# Altium project Flip.PrjPcb
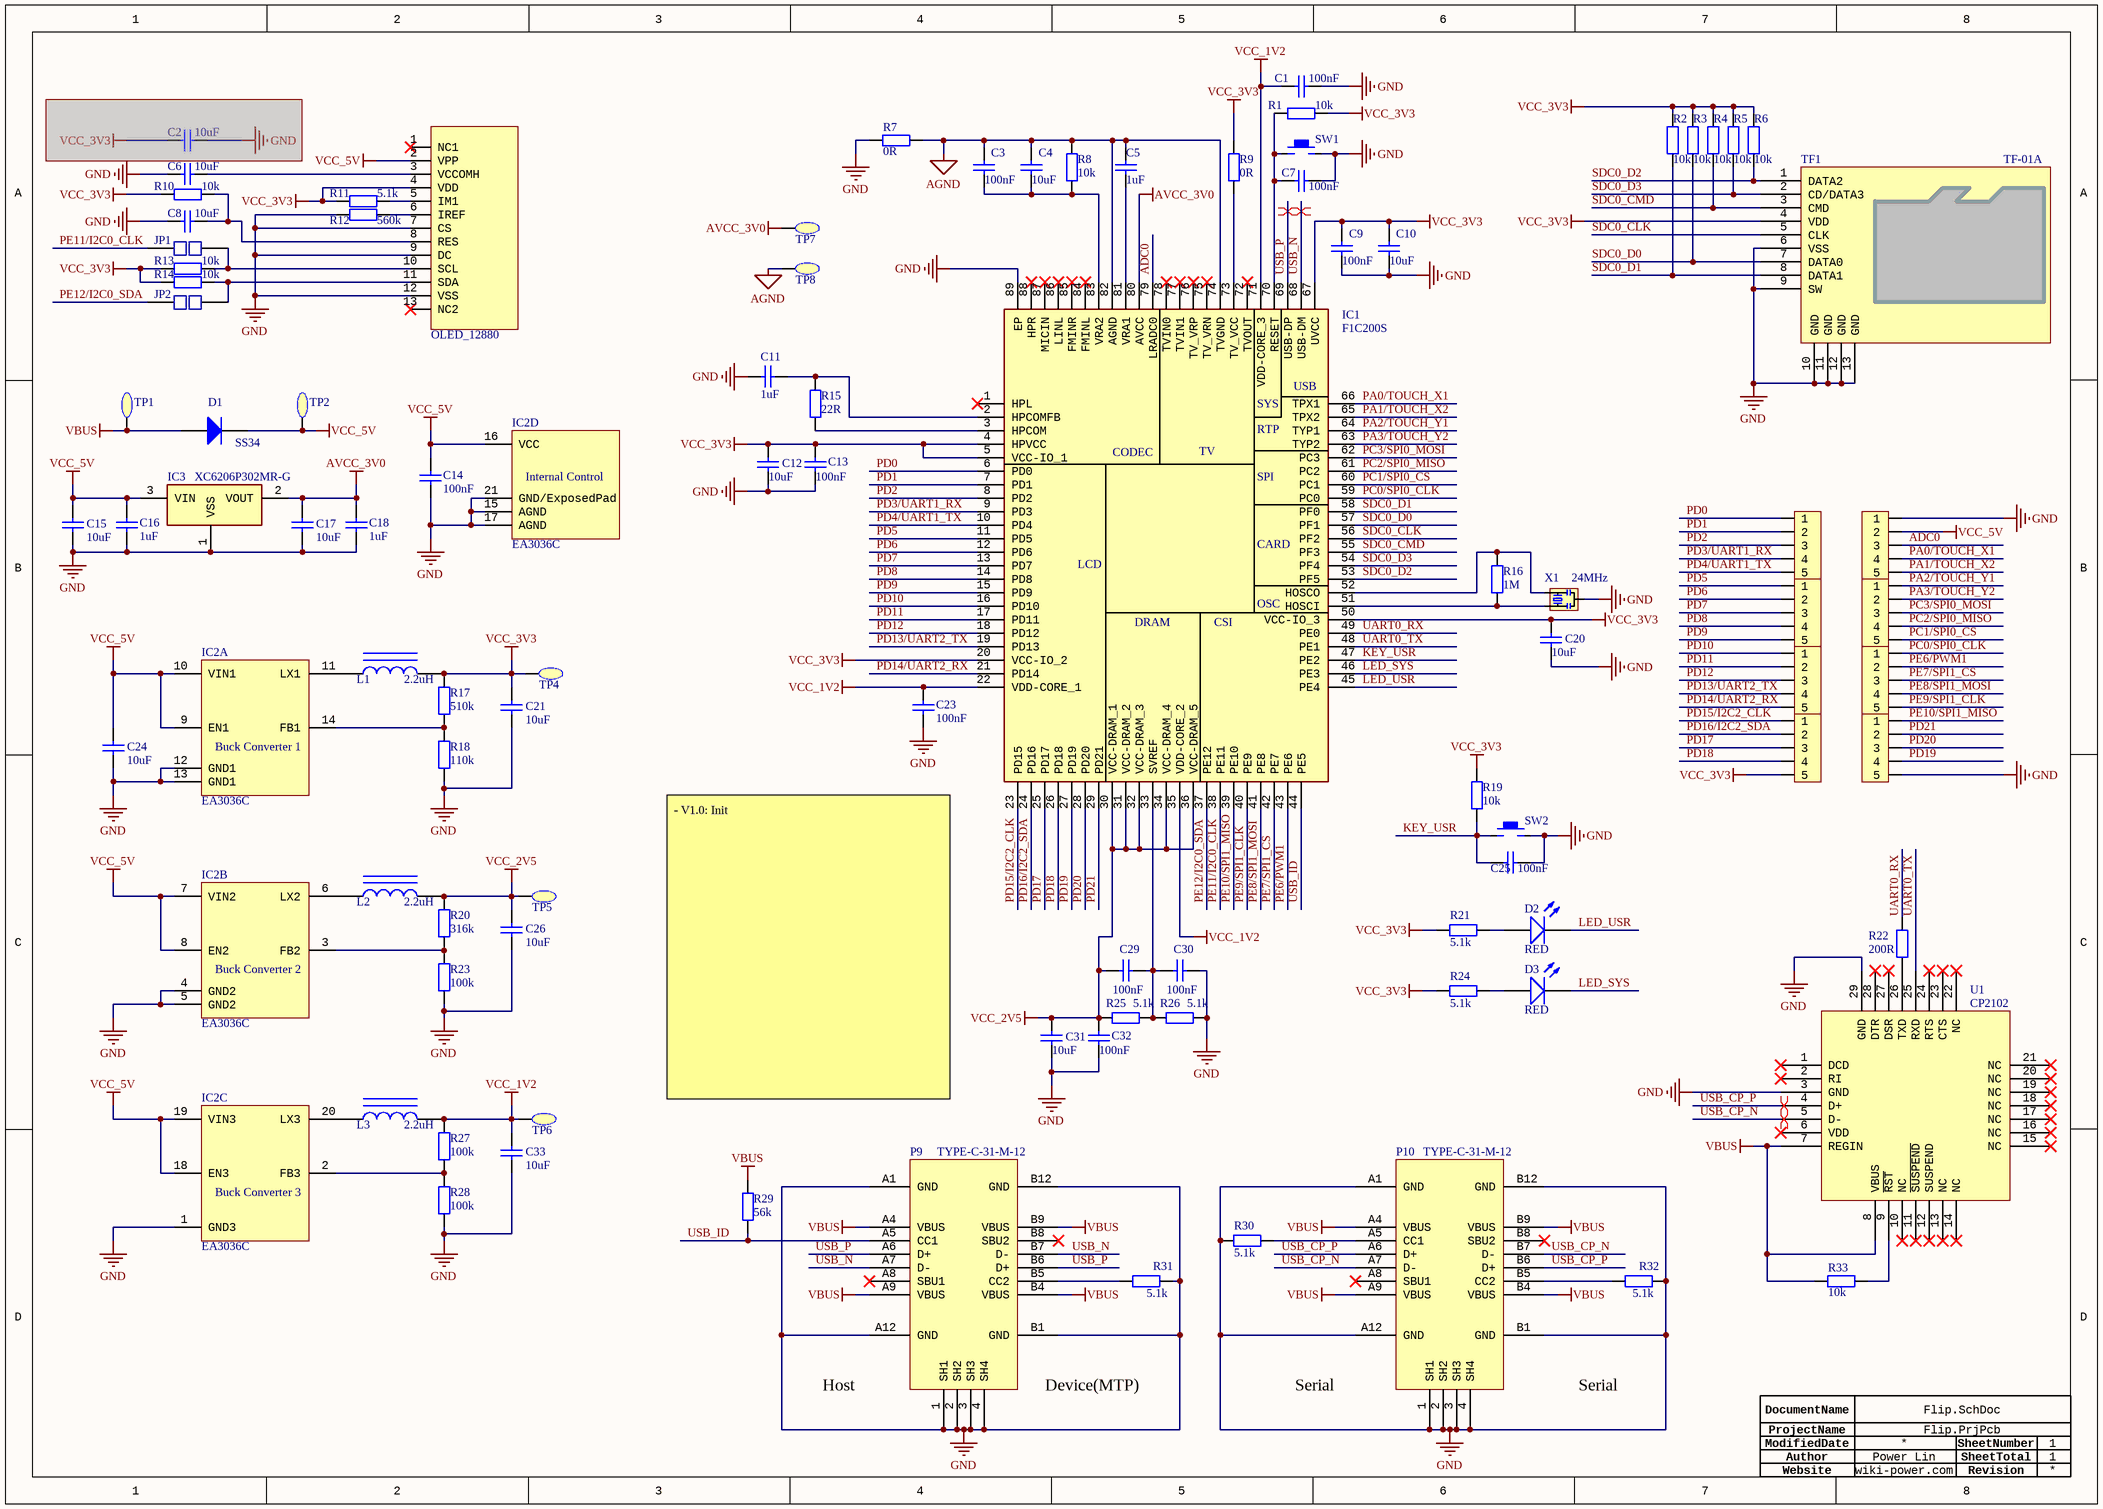
[diagram p0: Flip.SchDoc]
1 sheet, 96 parts. Net scope: global (net labels, ports and power ports of the same name join across sheets).
Board file: Flip.PcbDoc

## Sheet Flip.SchDoc
size A3; Author: Power Lin; SheetNumber: 1; SheetTotal: 1; Website: wiki-power.com

### Parts
C1  100nF  [CAP-0402]
C2  10uF  [CAP-0402]  (masked out: inside a compile mask, not in the netlist)
C3  100nF  [CAP-0402]
C4  10uF  [CAP-0402]
C5  1uF  [CAP-0402]
C6  10uF  [CAP-0402]
C7  100nF  [CAP-0402]
C8  10uF  [CAP-0402]
C9  100nF  [CAP-0402]
C10  10uF  [CAP-0402]
C11  1uF  [CAP-0402]
C12  10uF  [CAP-0402]
C13  100nF  [CAP-0402]
C14  100nF  [CAP-0402]
C15  10uF  [CAP-0402]
C16  1uF  [CAP-0402]
C17  10uF  [CAP-0402]
C18  1uF  [CAP-0402]
C20  10uF  [CAP-0402]
C21  10uF  [CAP-0402]
C23  100nF  [CAP-0402]
C24  10uF  [CAP-0402]
C25  100nF  [CAP-0402]
C26  10uF  [CAP-0402]
C29  100nF  [CAP-0402]
C30  100nF  [CAP-0402]
C31  10uF  [CAP-0402]
C32  100nF  [CAP-0402]
C33  10uF  [CAP-0402]
D1  SS34  [DO-214AC/SMA]
D2  RED  [LED-0402]
D3  RED  [LED-0402]
IC1  F1C200S  [QFN88P_10X10mm]
IC2  EA3036C  [QFN3mmx3mm-20]  (parts A,B,C,D of 4)
IC3  XC6206P302MR-G  [SOT-23-3]
JP1  Select  [选择焊点-0402]  (value not drawn)
JP2  Select  [选择焊点-0402]  (value not drawn)
L1  2.2uH  [L-1008]
L2  2.2uH  [L-1008]
L3  2.2uH  [L-1008]
M1  OLED_12880  [OLED_0.78INCH_12880]
P1  HDR1x5  [HDR1X5_2.54_180_BLANK]  (value not drawn)
P2  HDR1x5  [HDR1X5_2.54_180_BLANK]  (value not drawn)
P3  HDR1x5  [HDR1X5_2.54_180_BLANK]  (value not drawn)
P4  HDR1x5  [HDR1X5_2.54_180_BLANK]  (value not drawn)
P5  HDR1x5  [HDR1X5_2.54_180_BLANK]  (value not drawn)
P6  HDR1x5  [HDR1X5_2.54_180_BLANK]  (value not drawn)
P7  HDR1x5  [HDR1X5_2.54_180_BLANK]  (value not drawn)
P8  HDR1x5  [HDR1X5_2.54_180_BLANK]  (value not drawn)
P9  TYPE-C-31-M-12  [Type-C_16+4P]
P10  TYPE-C-31-M-12  [Type-C_16+4P]
R1  10k  [R-0402]
R2  10k  [R-0402]
R3  10k  [R-0402]
R4  10k  [R-0402]
R5  10k  [R-0402]
R6  10k  [R-0402]
R7  0R  [R-0402]
R8  10k  [R-0402]
R9  0R  [R-0402]
R10  10k  [R-0402]
R11  5.1k  [R-0402]
R12  560k  [R-0402]
R13  10k  [R-0402]
R14  10k  [R-0402]
R15  22R  [R-0402]
R16  1M  [R-0402]
R17  510k  [R-0402]
R18  110k  [R-0402]
R19  10k  [R-0402]
R20  316k  [R-0402]
R21  5.1k  [R-0402]
R22  200R  [R-0402]
R23  100k  [R-0402]
R24  5.1k  [R-0402]
R25  5.1k  [R-0402]
R26  5.1k  [R-0402]
R27  100k  [R-0402]
R28  100k  [R-0402]
R29  56k  [R-0402]
R30  5.1k  [R-0402]
R31  5.1k  [R-0402]
R32  5.1k  [R-0402]
R33  10k  [R-0402]
SW1  KEY  [KEY-4P-4.2*3.4*2.5]  (value not drawn)
SW2  KEY  [KEY-4P-4.2*3.4*2.5]  (value not drawn)
TF1  TF-01A  [TF_1]
TP1  TestPoint  [TestPoint]  (value not drawn)
TP2  TestPoint  [TestPoint]  (value not drawn)
TP4  TestPoint  [TestPoint]  (value not drawn)
TP5  TestPoint  [TestPoint]  (value not drawn)
TP6  TestPoint  [TestPoint]  (value not drawn)
TP7  TestPoint  [TestPoint]  (value not drawn)
TP8  TestPoint  [TestPoint]  (value not drawn)
U1  CP2102  [QFN28]
X1  24MHz  [SMD3213-3P]

### Nets
AGND: C3.1 C4.2 C5.1 IC1.74(TVGND) IC1.82(AGND) R7.1 R8.2 TP8.1
AVCC_3V0: C17.2 C18.1 IC1.80(AVCC) IC3.2(VOUT) TP7.1
GND: C1.1 C6.2 C7.1 C8.2 C9.2 C10.1 C11.1 C12.1 C13.1 C14.1 C15.1 C16.2 C17.1 C18.2 C20.1 C21.1 C23.1 C24.1 C25.1 C26.1 C30.2 C31.1 C32.1 C33.1 IC1.89(EP) IC2.1(GND3) IC2.4(GND2) IC2.5(GND2) IC2.12(GND1) IC2.13(GND1) IC2.15(AGND) IC2.17(AGND) IC2.21(GND/ExposedPad) IC3.1(VSS) M1.7(CS) M1.9(DC) M1.12(VSS) P2.1 P8.5 P9.1(SH1) P9.2(SH2) P9.3(SH3) P9.4(SH4) P9.A1(GND) P9.A12(GND) P9.B1(GND) P9.B12(GND) P10.1(SH1) P10.2(SH2) P10.3(SH3) P10.4(SH4) P10.A1(GND) P10.A12(GND) P10.B1(GND) P10.B12(GND) R7.2 R12.1 R18.1 R23.1 R26.2 R28.1 R30.2 R31.2 R32.2 SW1.2 SW2.2 TF1.6(VSS) TF1.9(SW) TF1.10(GND) TF1.11(GND) TF1.12(GND) TF1.13(GND) U1.3(GND) U1.29(GND) X1.2(GND)
VBUS: D1.1(A) P9.A4(VBUS) P9.A9(VBUS) P9.B4(VBUS) P9.B9(VBUS) P10.A4(VBUS) P10.A9(VBUS) P10.B4(VBUS) P10.B9(VBUS) R29.1 R33.2 TP1.1 U1.7(REGIN) U1.8(VBUS)
VCC_1V2: C1.2 C23.2 C33.2 IC1.22(VDD-CORE_1) IC1.35(VDD-CORE_2) IC1.71(VDD-CORE_3) L3.2 R27.2 TP6.1
VCC_2V5: C26.2 C29.1 C31.2 C32.2 IC1.30(VCC-DRAM_1) IC1.31(VCC-DRAM_2) IC1.32(VCC-DRAM_3) IC1.34(VCC-DRAM_4) IC1.36(VCC-DRAM_5) L2.2 R20.2 R25.1 TP5.1
VCC_3V3: C9.1 C10.2 C12.2 C13.2 C20.2 C21.2 IC1.4(HPVCC) IC1.5(VCC-IO_1) IC1.20(VCC-IO_2) IC1.50(VCC-IO_3) IC1.67(UVCC) L1.2 M1.4(VDD) P7.5 R1.2 R2.2 R3.2 R4.2 R5.2 R6.2 R9.2 R10.1 R11.1 R13.1 R14.1 R17.2 R19.2 R21.1 R24.1 TF1.4(VDD) TP4.1
VCC_5V: C14.2 C15.2 C16.1 C24.2 D1.2(K) IC2.7(VIN2) IC2.8(EN2) IC2.9(EN1) IC2.10(VIN1) IC2.16(VCC) IC2.18(EN3) IC2.19(VIN3) IC3.3(VIN) M1.2(VPP) P2.2 TP2.1
ADC0: IC1.79(LRADC0) P2.3
KEY_USR: C25.2 IC1.47(PE2) R19.1 SW2.1
LED_SYS: D3.K IC1.46(PE3)
LED_USR: D2.K IC1.45(PE4)
PA0/TOUCH_X1: IC1.66(TPX1) P2.4
PA1/TOUCH_X2: IC1.65(TPX2) P2.5
PA2/TOUCH_Y1: IC1.64(TYP1) P4.1
PA3/TOUCH_Y2: IC1.63(TYP2) P4.2
PC0/SPI0_CLK: IC1.59(PC0) P6.1
PC1/SPI0_CS: IC1.60(PC1) P4.5
PC2/SPI0_MISO: IC1.61(PC2) P4.4
PC3/SPI0_MOSI: IC1.62(PC3) P4.3
PD0: IC1.6(PD0) P1.1
PD1: IC1.7(PD1) P1.2
PD2: IC1.8(PD2) P1.3
PD3/UART1_RX: IC1.9(PD3) P1.4
PD4/UART1_TX: IC1.10(PD4) P1.5
PD5: IC1.11(PD5) P3.1
PD6: IC1.12(PD6) P3.2
PD7: IC1.13(PD7) P3.3
PD8: IC1.14(PD8) P3.4
PD9: IC1.15(PD9) P3.5
PD10: IC1.16(PD10) P5.1
PD11: IC1.17(PD11) P5.2
PD12: IC1.18(PD12) P5.3
PD13/UART2_TX: IC1.19(PD13) P5.4
PD14/UART2_RX: IC1.21(PD14) P5.5
PD15/I2C2_CLK: IC1.23(PD15) P7.1
PD16/I2C2_SDA: IC1.24(PD16) P7.2
PD17: IC1.25(PD17) P7.3
PD18: IC1.26(PD18) P7.4
PD19: IC1.27(PD19) P8.4
PD20: IC1.28(PD20) P8.3
PD21: IC1.29(PD21) P8.2
PE6/PWM1: IC1.43(PE6) P6.2
PE7/SPI1_CS: IC1.42(PE7) P6.3
PE8/SPI1_MOSI: IC1.41(PE8) P6.4
PE9/SPI1_CLK: IC1.40(PE9) P6.5
PE10/SPI1_MISO: IC1.39(PE10) P8.1
PE11/I2C0_CLK: IC1.38(PE11) JP1.1
PE12/I2C0_SDA: IC1.37(PE12) JP2.1
SDC0_CLK: IC1.56(PF2) TF1.5(CLK)
SDC0_CMD: IC1.55(PF3) R4.1 TF1.3(CMD)
SDC0_D0: IC1.57(PF1) R3.1 TF1.7(DATA0)
SDC0_D1: IC1.58(PF0) R2.1 TF1.8(DATA1)
SDC0_D2: IC1.53(PF5) R6.1 TF1.1(DATA2)
SDC0_D3: IC1.54(PF4) R5.1 TF1.2(CD/DATA3)
UART0_RX: IC1.49(PE0) R22.1
UART0_TX: IC1.48(PE1) U1.25(RXD)
USB_CP_N: P10.A7(D-) P10.B7(D-) U1.5(D-)
USB_CP_P: P10.A6(D+) P10.B6(D+) U1.4(D+)
USB_ID: IC1.44(PE5) P9.A5(CC1) R29.2
USB_N: IC1.68(USB-DM) P9.A7(D-) P9.B7(D-)
USB_P: IC1.69(USB-DP) P9.A6(D+) P9.B6(D+)
NetC3_2: C3.2 C4.1 IC1.83(VRA2) R8.1
NetC5_2: C5.2 IC1.81(VRA1)
NetC6_1: C6.1 M1.3(VCCOMH)
NetC7_2: C7.2 IC1.70(RESET) R1.1 SW1.1
NetC8_1: C8.1 M1.8(RES) R10.2
NetC11_2: C11.2 IC1.2(HPCOMFB) R15.2
NetC29_2: C29.2 C30.1 IC1.33(SVREF) R25.2 R26.1
NetD2_A: D2.A R21.2
NetD3_A: D3.A R24.2
NetIC1_3: IC1.3(HPCOM) R15.1
NetIC1_51: IC1.51(HOSCI) R16.1 X1.1(OSC1)
NetIC1_52: IC1.52(HOSCO) R16.2 X1.3(OSC2)
NetIC1_73: IC1.73(TV_VCC) R9.1
NetIC2_2: IC2.2(FB3) R27.1 R28.2
NetIC2_3: IC2.3(FB2) R20.1 R23.2
NetIC2_6: IC2.6(LX2) L2.1
NetIC2_11: IC2.11(LX1) L1.1
NetIC2_14: IC2.14(FB1) R17.1 R18.2
NetIC2_20: IC2.20(LX3) L3.1
NetJP1_2: JP1.2 M1.10(SCL) R13.2
NetJP2_2: JP2.2 M1.11(SDA) R14.2
NetM1_5: M1.5(IM1) R11.2
NetM1_6: M1.6(IREF) R12.2
NetP9_B5: P9.B5(CC2) R31.1
NetP10_A5: P10.A5(CC1) R30.1
NetP10_B5: P10.B5(CC2) R32.1
NetR22_2: R22.2 U1.26(TXD)
NetR33_1: R33.1 U1.9(~{RST})

Not connected (* = marked no-connect by the designer): IC1 1(HPL)* 72(TVOUT)* 75(TV_VRN)* 76(TV_VRP)* 77(TVIN1)* 78(TVIN0)* 84(FMINL)* 85(FMINR)* 86(LINL)* 87(MICIN)* 88(HPR)*; M1 1(NC1)* 13(NC2)*; P9 A8(SBU1)* B8(SBU2)*; P10 A8(SBU1)* B8(SBU2)*; U1 1(DCD)* 2(RI)* 6(VDD)* 10(NC)* 11(~{SUSPEND})* 12(SUSPEND)* 13(NC)* 14(NC)* 15(NC)* 16(NC)* 17(NC)* 18(NC)* 19(NC)* 20(NC)* 21(NC)* 22(NC)* 23(CTS)* 24(RTS)* 27(DSR)* 28(DTR)*

### Layout directives
differential pair: USB_CP_N, USB_CP_P, USB_N, USB_P

### Notes on the sheet
- - V1.0: Init
- (near P9) Host
- (near P9) Device(MTP)
- (near P10) Serial
- Serial
- Author
- DocumentName
- ModifiedDate
- ProjectName
- SheetNumber
- SheetTotal
- Website
- Revision
- (in symbol EA3036C, part A) Buck Converter 1
- (in symbol EA3036C, part B) Buck Converter 2
- (in symbol EA3036C, part C) Buck Converter 3
- (in symbol EA3036C, part D) Internal Control
- (in symbol F1C100S/F1C200S) USB; SYS; RTP; CODEC; TV; SPI; CARD; LCD; OSC; DRAM; CSI

### Library data of the parts
C1-C18 C20 C21 C23-C26 C29-C33 = CAP: 贴片电容; ComponentLink1Description: 供应商链接; ComponentLink1URL: http://www.szlcsc.com/product/details_53938.html; Package: 0402; Supplier: LC; SuppliersPartNumber: C52923
D1 = DIODE: 肖特基二极管; ComponentLink1Description: 供应商链接; ComponentLink1URL: http://www.szlcsc.com/product/details_23178.html; Package: SMA(DO-214AC); Supplier: LC; SuppliersPartNumber: C22452
D2 D3 = LED: 发光二极管; pin to pad: A>1 K>2; ComponentLink1Description: 供应商链接; ComponentLink1URL: http://www.szlcsc.com/product/details_2663.html; Package: 0603; Supplier: LC; SuppliersPartNumber: C2290
IC1 = F1C100S/F1C200S: SOC; Manufacturer_Name: Allwinner Technology; Datasheet Link: https://linux-sunxi.org/images/1/11/Allwinner_F1C200s_Datasheet_V1.0.pdf; Height: 0.9mm; Manufacturer_Part_Number: F1C200S
IC2 = EA3036C: EA3036 is a 3CH power management IC for applications powered by one Li-Ion battery or a DC 5V adapter.
IC3 = XC6206: LDO; Manufacturer_Name: Torex; Manufacturer_Part_Number: XC6206P122MR-G; Datasheet Link: https://www.torexsemi.com/file/xc6206/XC6206.pdf; Height: 1.3mm; Mouser Part Number: 865-XC6206P122MR-G; Mouser Price/Stock: https://www.mouser.co.uk/ProductDetail/Torex-Semiconductor/XC6206P122MR-G?qs=AsjdqWjXhJ%2F35%2FU%2FZk2JYg%3D%3D
JP1 JP2 = Select: 选择焊点
L1-L3 = INDUCTOR: SRN2512-2R2M; ComponentLink1Description: 供应商链接; ComponentLink1URL: http://www.szlcsc.com/product/details_33003.html; Package: 0402; Supplier: LC; SuppliersPartNumber: C32041
M1 = OLED_12880: OLED屏
P1-P8 = HDR1x5_2.54: Header; Manufacturer_Name: FCI Electronics; Manufacturer_Part_Number: 10129378-905001BLF; Datasheet Link: https://cdn.amphenol-icc.com/media/wysiwyg/files/drawing/10129378.pdf; Height: 8.58mm; Mouser Part Number: 649-1012937890501BLF; Mouser Price/Stock: https://www.mouser.com/Search/Refine.aspx?Keyword=649-1012937890501BLF
P9 P10 = USB_Type-C_16+4P: USB Type-C 座子
R1-R16 R19 R21 R22 R24-R26 R29-R33 = RES: 贴片电阻; Package: 0805; Supplier: LC; SuppliersPartNumber: C17798
R17 R18 = RES: RC0402FR-07510KL; Package: 0805; Supplier: LC; SuppliersPartNumber: C17798
R20 = RES: RC0402FR-07316KL; Package: 0805; Supplier: LC; SuppliersPartNumber: C17798
R23 R27 R28 = RES: RC0402FR-07100KL; Package: 0805; Supplier: LC; SuppliersPartNumber: C17798
SW1 SW2 = KEY: 按键开关
TF1 = TF卡座_8脚自弹: 与TF-01A封装相似则可替换
TP1 TP2 TP4-TP8 = TestPoint: 测试点
U1 = CP2102: CP2102-GMR
X1 = XTAL: 村田无源晶振